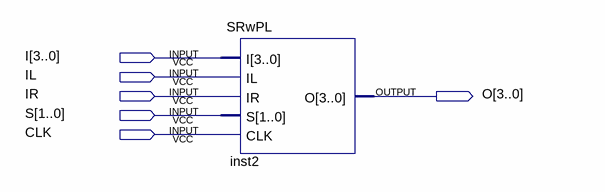
[diagram p0: schematic sheet]
// Quartus schematic btbuoi2.bdf as structural Verilog: 1 symbols, 6 pins
module btbuoi2 (
  input  [3:0] I,
  input  IL,
  input  IR,
  input  [1:0] S,
  input  CLK,
  output [3:0] O
);

  SRwPL inst2 (.I(I), .IL(IL), .IR(IR), .S(S), .CLK(CLK), .O(O));
endmodule
